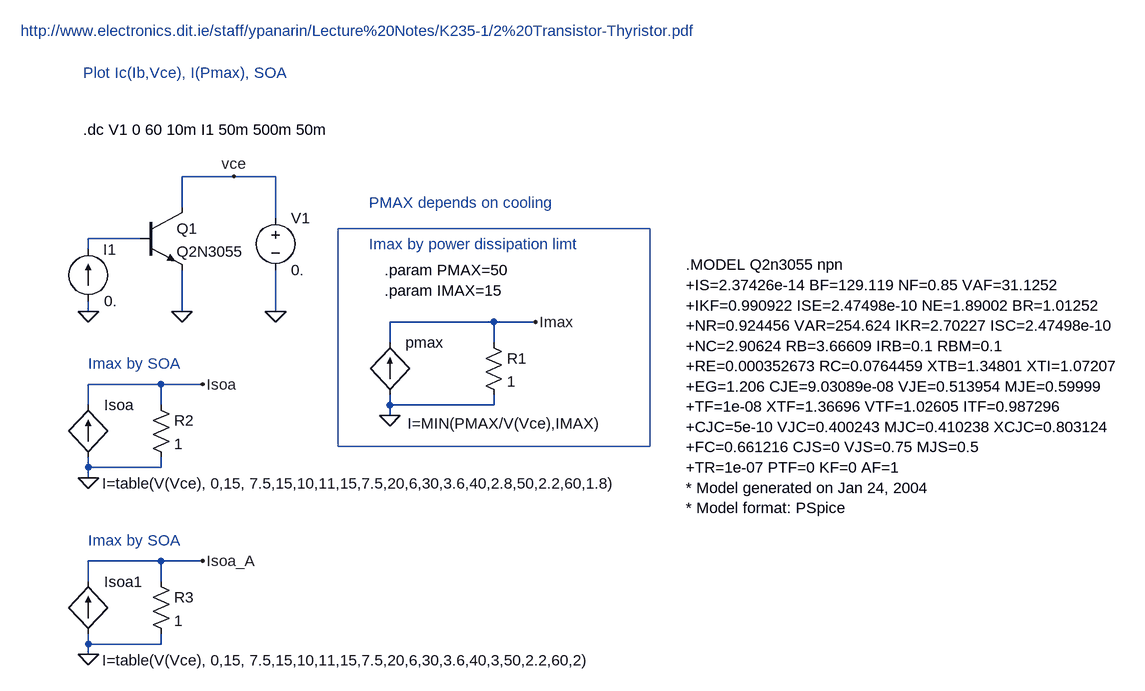
[diagram p0: schematic curve_trace_example.asc]
curve_trace_example.asc, the LTspice schematic file:
Version 4
SHEET 1 3464 2260
WIRE 2016 960 1936 960
WIRE 2080 960 2016 960
WIRE 1936 1008 1936 960
WIRE 2080 1024 2080 960
WIRE 1872 1056 1792 1056
WIRE 1792 1072 1792 1056
WIRE 1792 1168 1792 1152
WIRE 1936 1168 1936 1104
WIRE 2080 1168 2080 1104
WIRE 2416 1184 2256 1184
WIRE 2480 1184 2416 1184
WIRE 2256 1216 2256 1184
WIRE 2416 1216 2416 1184
WIRE 1904 1280 1792 1280
WIRE 1968 1280 1904 1280
WIRE 1792 1312 1792 1280
WIRE 1904 1312 1904 1280
WIRE 2256 1312 2256 1296
WIRE 2416 1312 2416 1296
WIRE 2416 1312 2256 1312
WIRE 2256 1328 2256 1312
WIRE 1792 1408 1792 1392
WIRE 1904 1408 1904 1392
WIRE 1904 1408 1792 1408
WIRE 1792 1424 1792 1408
WIRE 1904 1552 1792 1552
WIRE 1968 1552 1904 1552
WIRE 1792 1584 1792 1552
WIRE 1904 1584 1904 1552
WIRE 1792 1680 1792 1664
WIRE 1904 1680 1904 1664
WIRE 1904 1680 1792 1680
WIRE 1792 1696 1792 1680
FLAG 2080 1168 0
FLAG 1936 1168 0
FLAG 1792 1168 0
FLAG 2016 960 vce
FLAG 2480 1184 Imax
FLAG 2256 1328 0
FLAG 1968 1280 Isoa
FLAG 1792 1424 0
FLAG 1968 1552 Isoa_A
FLAG 1792 1696 0
SYMBOL npn 1872 1008 R0
SYMATTR InstName Q1
SYMATTR Value Q2N3055
SYMBOL voltage 2080 1008 R0
SYMATTR InstName V1
SYMATTR Value 0.
SYMBOL current 1792 1152 M180
WINDOW 0 23 79 Left 0
WINDOW 3 24 0 Left 0
SYMATTR InstName I1
SYMATTR Value 0.
SYMBOL res 2400 1200 R0
SYMATTR InstName R1
SYMATTR Value 1
SYMBOL bi2 2256 1216 R0
WINDOW 3 27 124 Left 0
SYMATTR Value I=MIN(PMAX/V(Vce),IMAX)
SYMATTR InstName pmax
SYMBOL res 1888 1296 R0
SYMATTR InstName R2
SYMATTR Value 1
SYMBOL bi2 1792 1312 R0
WINDOW 3 21 121 Left 0
SYMATTR Value I=table(V(Vce), 0,15, 7.5,15,10,11,15,7.5,20,6,30,3.6,40,2.8,50,2.2,60,1.8)
SYMATTR InstName Isoa
SYMBOL res 1888 1568 R0
SYMATTR InstName R3
SYMATTR Value 1
SYMBOL bi2 1792 1584 R0
WINDOW 3 21 121 Left 0
SYMATTR Value I=table(V(Vce), 0,15, 7.5,15,10,11,15,7.5,20,6,30,3.6,40,3,50,2.2,60,2)
SYMATTR InstName Isoa1
TEXT 1784 888 Left 0 !.dc V1 0 60 10m I1 50m 500m 50m
TEXT 2248 1104 Left 0 !.param PMAX=50
TEXT 1784 800 Left 0 ;Plot Ic(Ib,Vce), I(Pmax), SOA
TEXT 2248 1136 Left 0 !.param IMAX=15
TEXT 2224 1064 Left 0 ;Imax by power dissipation limt
TEXT 1792 1248 Left 0 ;Imax by SOA
TEXT 2224 1000 Left 0 ;PMAX depends on cooling
TEXT 1688 736 Left 0 ;http://www.electronics.dit.ie/staff/ypanarin/Lecture%20Notes/K235-1/2%20Transistor-Thyristor.pdf
TEXT 1792 1520 Left 0 ;Imax by SOA
TEXT 2712 1096 Left 0 !.MODEL Q2n3055 npn\n+IS=2.37426e-14 BF=129.119 NF=0.85 VAF=31.1252\n+IKF=0.990922 ISE=2.47498e-10 NE=1.89002 BR=1.01252\n+NR=0.924456 VAR=254.624 IKR=2.70227 ISC=2.47498e-10\n+NC=2.90624 RB=3.66609 IRB=0.1 RBM=0.1\n+RE=0.000352673 RC=0.0764459 XTB=1.34801 XTI=1.07207\n+EG=1.206 CJE=9.03089e-08 VJE=0.513954 MJE=0.59999\n+TF=1e-08 XTF=1.36696 VTF=1.02605 ITF=0.987296\n+CJC=5e-10 VJC=0.400243 MJC=0.410238 XCJC=0.803124\n+FC=0.661216 CJS=0 VJS=0.75 MJS=0.5\n+TR=1e-07 PTF=0 KF=0 AF=1\n* Model generated on Jan 24, 2004\n* Model format: PSpice
RECTANGLE Normal 2656 1376 2176 1040

The netlist it stands for:
* curve_trace_example.asc
Q1 vce N001 0 0 Q2N3055
V1 vce 0 0.
I1 0 N001 0.
R1 Imax 0 1
B§pmax 0 Imax I=MIN(PMAX/V(Vce),IMAX)
R2 Isoa 0 1
B§Isoa 0 Isoa I=table(V(Vce), 0,15, 7.5,15,10,11,15,7.5,20,6,30,3.6,40,2.8,50,2.2,60,1.8)
R3 Isoa_A 0 1
B§Isoa1 0 Isoa_A I=table(V(Vce), 0,15, 7.5,15,10,11,15,7.5,20,6,30,3.6,40,3,50,2.2,60,2)
.model NPN NPN
.model PNP PNP
.lib standard.bjt
.dc V1 0 60 10m I1 50m 500m 50m
.param PMAX=50
* Plot Ic(Ib,Vce), I(Pmax), SOA
.param IMAX=15
* Imax by power dissipation limt
* Imax by SOA
* PMAX depends on cooling
* http://www.electronics.dit.ie/staff/ypanarin/Lecture%20Notes/K235-1/2%20Transistor-Thyristor.pdf
* Imax by SOA
.MODEL Q2n3055 npn
+IS=2.37426e-14 BF=129.119 NF=0.85 VAF=31.1252
+IKF=0.990922 ISE=2.47498e-10 NE=1.89002 BR=1.01252
+NR=0.924456 VAR=254.624 IKR=2.70227 ISC=2.47498e-10
+NC=2.90624 RB=3.66609 IRB=0.1 RBM=0.1
+RE=0.000352673 RC=0.0764459 XTB=1.34801 XTI=1.07207
+EG=1.206 CJE=9.03089e-08 VJE=0.513954 MJE=0.59999
+TF=1e-08 XTF=1.36696 VTF=1.02605 ITF=0.987296
+CJC=5e-10 VJC=0.400243 MJC=0.410238 XCJC=0.803124
+FC=0.661216 CJS=0 VJS=0.75 MJS=0.5
+TR=1e-07 PTF=0 KF=0 AF=1
* Model generated on Jan 24, 2004
* Model format: PSpice
.backanno
.end